# EAGLE design Hank2 (EAGLE 7.7.0)
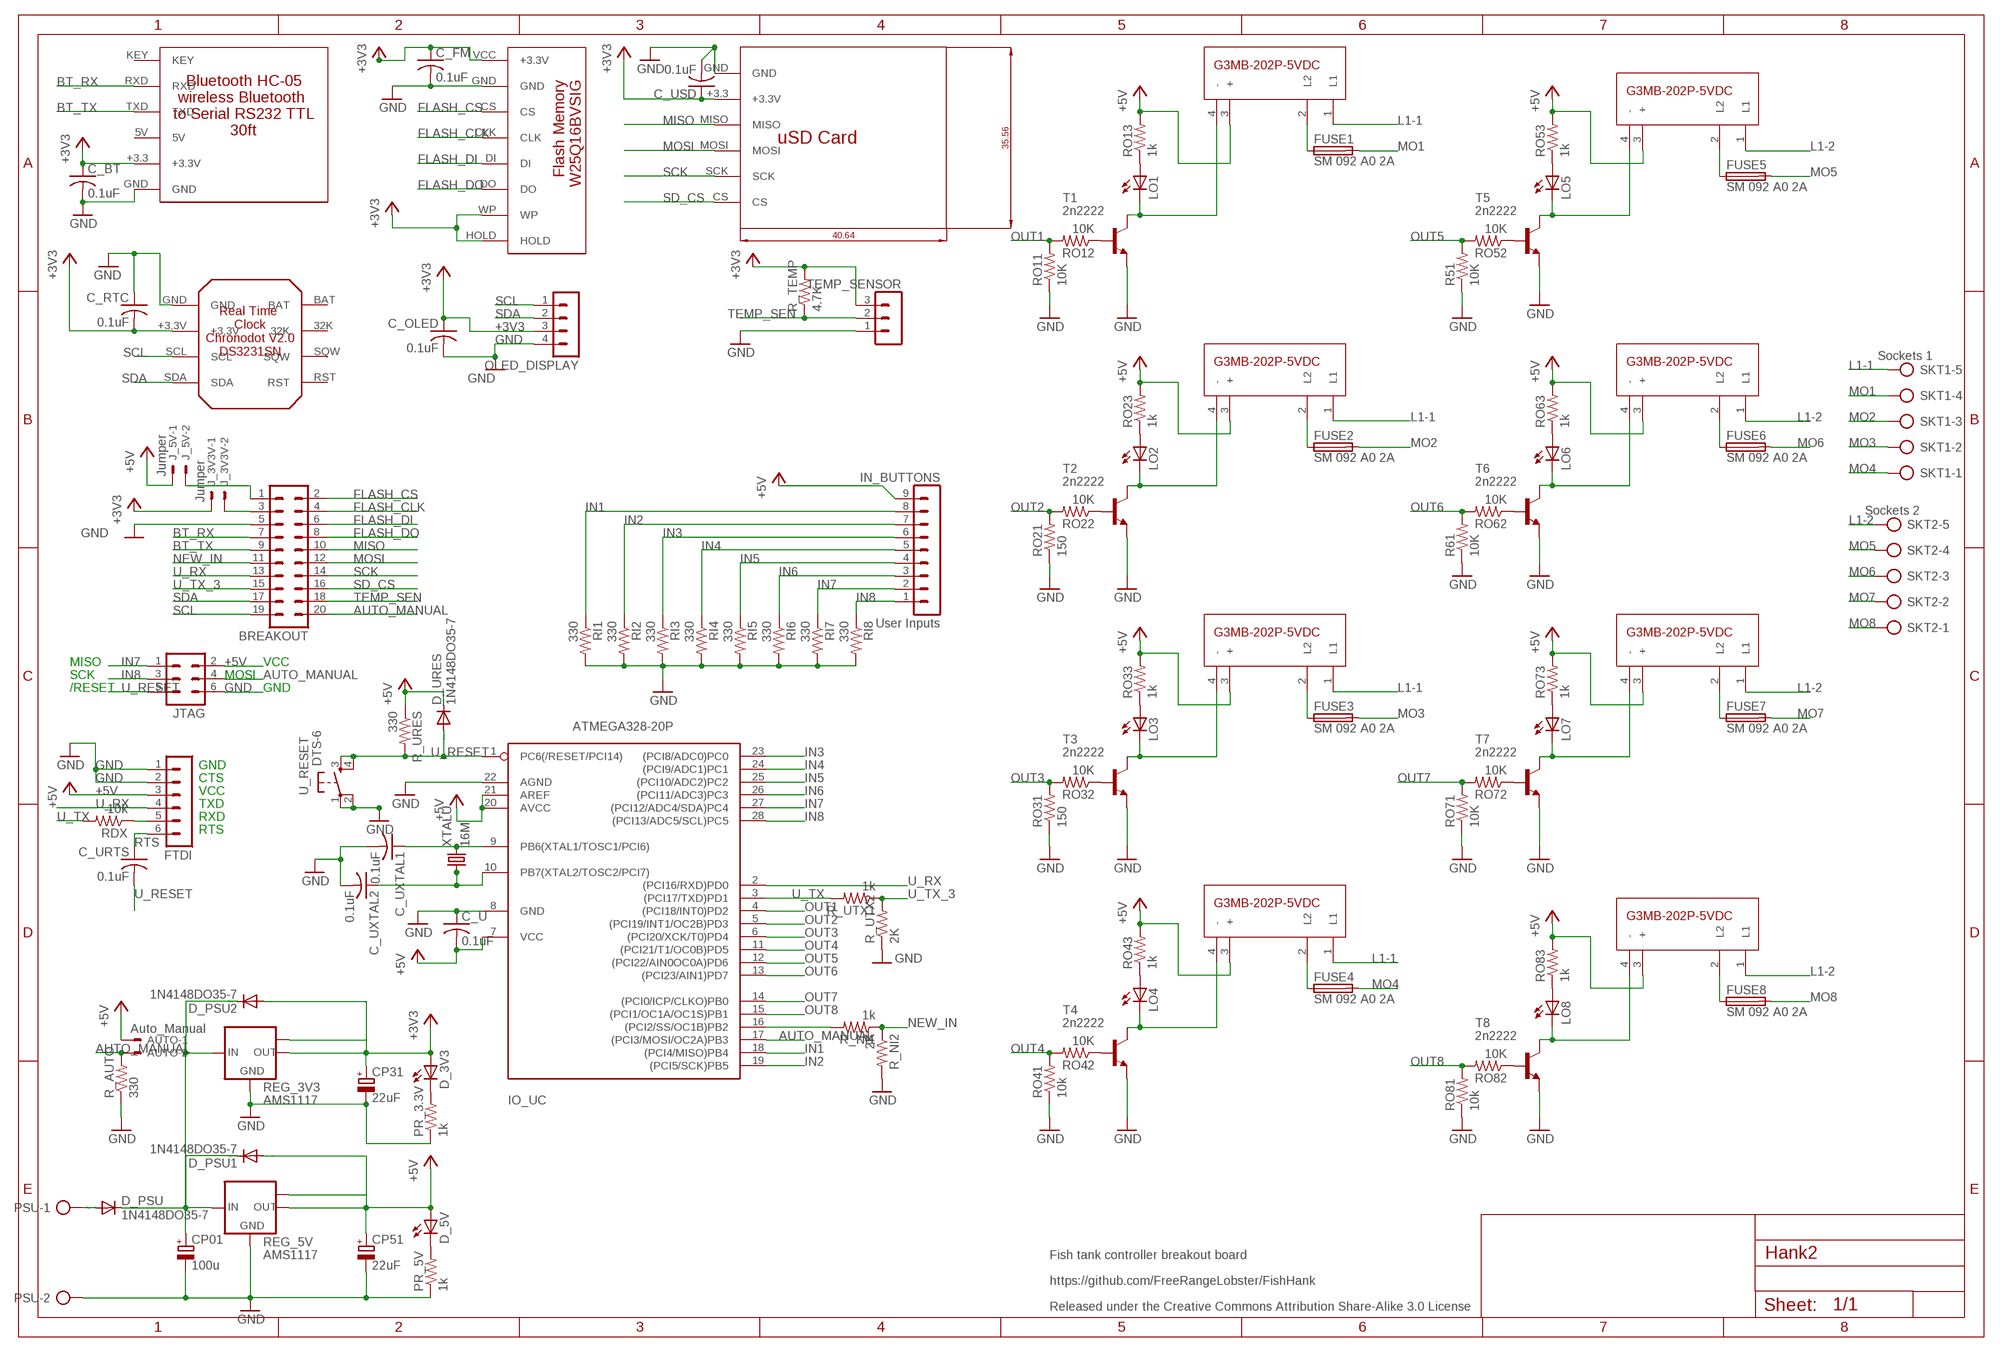
[diagram p0: schematic, sheet 1]

## Parts
AUTO  Auto_Manual  22-23-2021  [22-23-2021]
BREAKOUT  MA10-2  [MA10-2]
C_BT  0.1uF  C-US025-024X044  [C025-024X044]
C_FM  0.1uF  C-US025-024X044  [C025-024X044]
C_OLED  0.1uF  C-US025-024X044  [C025-024X044]
C_RTC  0.1uF  C-US025-024X044  [C025-024X044]
C_U  0.1uF  C-US025-024X044  [C025-024X044]
C_URTS  0.1uF  C-US025-024X044  [C025-024X044]
C_USD  0.1uF  C-US025-024X044  [C025-024X044]
C_UXTAL1  0.1uF  C-US025-024X044  [C025-024X044]
C_UXTAL2  0.1uF  C-US025-024X044  [C025-024X044]
CP01  100u  CPOL-EUE2.5-6  [E2,5-6]
CP31  22uF  CPOL-EUE2.5-6  [E2,5-6]
CP51  22uF  CPOL-EUE2.5-6  [E2,5-6]
D_3V3  LED3MM  [LED3MM]
D_5V  LED3MM  [LED3MM]
D_PSU  1N4148DO35-7  [DO35-7]
D_PSU1  1N4148DO35-7  [DO35-7]
D_PSU2  1N4148DO35-7  [DO35-7]
D_URES  1N4148DO35-7  [DO35-7]
FTDI  MA06-1  [MA06-1]
FUSE1  SM 092 A0 2A  FUSEPICOFUSE  [PICOFUSE]
FUSE2  SM 092 A0 2A  FUSEPICOFUSE  [PICOFUSE]
FUSE3  SM 092 A0 2A  FUSEPICOFUSE  [PICOFUSE]
FUSE4  SM 092 A0 2A  FUSEPICOFUSE  [PICOFUSE]
FUSE5  SM 092 A0 2A  FUSEPICOFUSE  [PICOFUSE]
FUSE6  SM 092 A0 2A  FUSEPICOFUSE  [PICOFUSE]
FUSE7  SM 092 A0 2A  FUSEPICOFUSE  [PICOFUSE]
FUSE8  SM 092 A0 2A  FUSEPICOFUSE  [PICOFUSE]
IN_BUTTONS  User Inputs  MA09-1  [MA09-1]
IO_UC  ATMEGA328-20P  [DIL28-3]
J_3V3V  Jumper  22-23-2021  [22-23-2021]
J_5V  Jumper  22-23-2021  [22-23-2021]
JTAG  MA03-2  [MA03-2]
LO1  LED3MM  [LED3MM]
LO2  LED3MM  [LED3MM]
LO3  LED3MM  [LED3MM]
LO4  LED3MM  [LED3MM]
LO5  LED3MM  [LED3MM]
LO6  LED3MM  [LED3MM]
LO7  LED3MM  [LED3MM]
LO8  LED3MM  [LED3MM]
OLED_DISPLAY  MA04-1  [MA04-1]
PR_3.3V  1k  R-US_0207/10  [0207/10]
PR_5V  1k  R-US_0207/10  [0207/10]
PSU  AK500/2  [AK500/2]
R51  10K  R-US_0207/10  [0207/10]
R61  10K  R-US_0207/10  [0207/10]
R_AUTO  330  R-US_0207/10  [0207/10]
R_NI1  1k  R-US_0207/10  [0207/10]
R_NI2  2K  R-US_0207/10  [0207/10]
R_TEMP  4.7K  R-US_0207/10  [0207/10]
R_URES  330  R-US_0207/10  [0207/10]
R_UTX1  1k  R-US_0207/10  [0207/10]
R_UTX2  2K  R-US_0207/10  [0207/10]
RDX  10k  R-US_0207/10  [0207/10]
REG_3V3  AMS1117  [SOT223]
REG_5V  AMS1117  [SOT223]
RI1  330  R-US_0207/10  [0207/10]
RI2  330  R-US_0207/10  [0207/10]
RI3  330  R-US_0207/10  [0207/10]
RI4  330  R-US_0207/10  [0207/10]
RI5  330  R-US_0207/10  [0207/10]
RI6  330  R-US_0207/10  [0207/10]
RI7  330  R-US_0207/10  [0207/10]
RI8  330  R-US_0207/10  [0207/10]
RO11  10K  R-US_0207/10  [0207/10]
RO12  10K  R-US_0207/10  [0207/10]
RO13  1k  R-US_0207/10  [0207/10]
RO21  150  R-US_0207/10  [0207/10]
RO22  10K  R-US_0207/10  [0207/10]
RO23  1k  R-US_0207/10  [0207/10]
RO31  150  R-US_0207/10  [0207/10]
RO32  10K  R-US_0207/10  [0207/10]
RO33  1k  R-US_0207/10  [0207/10]
RO41  10k  R-US_0207/10  [0207/10]
RO42  10K  R-US_0207/10  [0207/10]
RO43  1k  R-US_0207/10  [0207/10]
RO52  10K  R-US_0207/10  [0207/10]
RO53  1k  R-US_0207/10  [0207/10]
RO62  10K  R-US_0207/10  [0207/10]
RO63  1k  R-US_0207/10  [0207/10]
RO71  10K  R-US_0207/10  [0207/10]
RO72  10K  R-US_0207/10  [0207/10]
RO73  1k  R-US_0207/10  [0207/10]
RO81  10k  R-US_0207/10  [0207/10]
RO82  10K  R-US_0207/10  [0207/10]
RO83  1k  R-US_0207/10  [0207/10]
SKT1  Sockets 1  AK500/5  [AK500/5]
SKT2  Sockets 2  AK500/5  [AK500/5]
SSR1  SSR  [SSR_FOOTPRINT]
SSR2  SSR  [SSR_FOOTPRINT]
SSR3  SSR  [SSR_FOOTPRINT]
SSR4  SSR  [SSR_FOOTPRINT]
SSR5  SSR  [SSR_FOOTPRINT]
SSR6  SSR  [SSR_FOOTPRINT]
SSR7  SSR  [SSR_FOOTPRINT]
SSR8  SSR  [SSR_FOOTPRINT]
T1  2n2222  2SC458  [TO92-ECB]
T2  2n2222  2SC458  [TO92-ECB]
T3  2n2222  2SC458  [TO92-ECB]
T4  2n2222  2SC458  [TO92-ECB]
T5  2n2222  2SC458  [TO92-ECB]
T6  2n2222  2SC458  [TO92-ECB]
T7  2n2222  2SC458  [TO92-ECB]
T8  2n2222  2SC458  [TO92-ECB]
TEMP_SENSOR  MA03-1  [MA03-1]
U$1  FLASH_MEMORY  [FLASHMEMORY_FOOTPRINT]
U$4  BLUETOOTH  [BLUETOOTH_FOOTPRINT]
U$6  RTC  [RTC_FOOTPRINT]
U$7  SD_CARD_READER  [SD_CARD_READER_FOOTPRINT]
U_RESET  DTS-6  [DTS-6]
XTALU  16M  CRYSTALHC49S  [HC49/S]

## Nets
+3V3: C_BT.1 C_FM.1 C_OLED.1 C_RTC.2 C_USD.1 CP31.+ D_3V3.A D_PSU2.A J_3V3V.1 OLED_DISPLAY.3 R_TEMP.2 REG_3V3.2(OUT) REG_3V3.TAB(OUT1) TEMP_SENSOR.3 U$1.HOLD U$1.VCC(+3.3V) U$1.WP U$4.+3.3(+3.3V) U$6.+3.3V U$7.+3.3(+3.3V)
+5V: AUTO.1 C_U.2 CP51.+ D_5V.A D_PSU1.A D_URES.C FTDI.3 IN_BUTTONS.9 IO_UC.7(VCC) IO_UC.20(AVCC) IO_UC.21(AREF) J_5V.1 JTAG.2 R_URES.1 REG_5V.2(OUT) REG_5V.TAB(OUT1) RO13.2 RO23.2 RO33.2 RO43.2 RO53.2 RO63.2 RO73.2 RO83.2 SSR1.3(+) SSR2.3(+) SSR3.3(+) SSR4.3(+) SSR5.3(+) SSR6.3(+) SSR7.3(+) SSR8.3(+)
AUTO_MANUAL: AUTO.2 BREAKOUT.20 IO_UC.17((PCI3/MOSI/OC2A)PB3) JTAG.4 R_AUTO.2
BT_RX: BREAKOUT.7 U$4.RXD
BT_TX: BREAKOUT.9 U$4.TXD
CP12: CP01.+ D_PSU1.C D_PSU2.C D_PSU.C REG_3V3.3(IN) REG_5V.3(IN)
FLASH_CLK: BREAKOUT.4 U$1.CLK
FLASH_CS: BREAKOUT.2 U$1.CS
FLASH_DI: BREAKOUT.6 U$1.DI
FLASH_DO: BREAKOUT.8 U$1.DO
GND [vcc]: BREAKOUT.5 C_BT.2 C_FM.2 C_OLED.2 C_RTC.1 C_U.1 C_USD.2 C_UXTAL1.2 C_UXTAL2.2 CP01.- CP31.- CP51.- FTDI.1 FTDI.2 IO_UC.8(GND) IO_UC.22(AGND) JTAG.6 OLED_DISPLAY.4 PR_3.3V.1 PR_5V.1 PSU.2 R51.1 R61.1 R_AUTO.1 R_NI2.2 R_UTX2.1 REG_3V3.1(GND) REG_5V.1(GND) RI1.2 RI2.2 RI3.2 RI4.2 RI5.2 RI6.2 RI7.2 RI8.2 RO11.1 RO21.1 RO31.1 RO41.1 RO71.1 RO81.1 T1.E T2.E T3.E T4.E T5.E T6.E T7.E T8.E TEMP_SENSOR.1 U$1.GND U$4.GND U$6.GND U$7.GND U_RESET.1 U_RESET.2
IN1: IN_BUTTONS.8 IO_UC.18((PCI4/MISO)PB4) RI1.1
IN2: IN_BUTTONS.7 IO_UC.19((PCI5/SCK)PB5) RI2.1
IN3: IN_BUTTONS.6 IO_UC.23((PCI8/ADC0)PC0) RI3.1
IN4: IN_BUTTONS.5 IO_UC.24((PCI9/ADC1)PC1) RI4.1
IN5: IN_BUTTONS.4 IO_UC.25((PCI10/ADC2)PC2) RI5.1
IN6: IN_BUTTONS.3 IO_UC.26((PCI11/ADC3)PC3) RI6.1
IN7: IN_BUTTONS.2 IO_UC.27((PCI12/ADC4/SDA)PC4) JTAG.1 RI7.1
IN8: IN_BUTTONS.1 IO_UC.28((PCI13/ADC5/SCL)PC5) JTAG.3 RI8.1
L1-1: SKT1.5 SSR1.1(L1) SSR2.1(L1) SSR3.1(L1) SSR4.1(L1)
L1-2: SKT2.5 SSR5.1(L1) SSR6.1(L1) SSR7.1(L1) SSR8.1(L1)
L_O1: LO2.K(C) SSR2.4(-) T2.C
L_O3: LO3.K(C) SSR3.4(-) T3.C
MISO: BREAKOUT.10 U$7.MISO
MO1: FUSE1.2 SKT1.4
MO2: FUSE2.2 SKT1.3
MO3: FUSE3.2 SKT1.2
MO4: FUSE4.2 SKT1.1
MO5: FUSE5.2 SKT2.4
MO6: FUSE6.2 SKT2.3
MO7: FUSE7.2 SKT2.2
MO8: FUSE8.2 SKT2.1
MOSI: BREAKOUT.12 U$7.MOSI
N$1: BREAKOUT.1 J_5V.2
N$2: BREAKOUT.3 J_3V3V.2
N$3: FUSE1.1 SSR1.2(L2)
N$4: D_5V.K(C) PR_5V.2
N$5: D_3V3.K(C) PR_3.3V.2
N$7: D_PSU.A PSU.1
N$8: RO12.1 T1.B
N$9: RO52.1 T5.B
N$10: FUSE8.1 SSR8.2(L2)
N$11: LO5.A RO53.1
N$12: LO5.K(C) SSR5.4(-) T5.C
N$13: FUSE7.1 SSR7.2(L2)
N$14: FUSE2.1 SSR2.2(L2)
N$15: FUSE3.1 SSR3.2(L2)
N$16: LO6.A RO63.1
N$17: LO6.K(C) SSR6.4(-) T6.C
N$18: RO62.1 T6.B
N$19: FUSE6.1 SSR6.2(L2)
N$20: LO7.A RO73.1
N$21: LO7.K(C) SSR7.4(-) T7.C
N$22: RO72.1 T7.B
N$23: RO42.1 T4.B
N$24: FUSE4.1 SSR4.2(L2)
N$25: LO8.A RO83.1
N$26: LO8.K(C) SSR8.4(-) T8.C
N$27: RO32.1 T3.B
N$28: FUSE5.1 SSR5.2(L2)
N$29: LO1.A RO13.1
N$30: LO1.K(C) SSR1.4(-) T1.C
N$31: RO22.1 T2.B
N$32: C_UXTAL1.1 IO_UC.9(PB6(XTAL1/TOSC1/PCI6)) XTALU.2
N$33: LO2.A RO23.1
N$34: RO82.1 T8.B
N$35: C_UXTAL2.1 IO_UC.10(PB7(XTAL2/TOSC2/PCI7)) XTALU.1
N$37: LO3.A RO33.1
N$39: IO_UC.16((PCI2/SS/OC1B)PB2) R_NI1.2
N$41: LO4.A RO43.1
N$42: LO4.K(C) SSR4.4(-) T4.C
NEW_IN: BREAKOUT.11 R_NI1.1 R_NI2.1
OUT1: IO_UC.4((PCI18/INT0)PD2) RO11.2 RO12.2
OUT2: IO_UC.5((PCI19/INT1/OC2B)PD3) RO21.2 RO22.2
OUT3: IO_UC.6((PCI20/XCK/T0)PD4) RO31.2 RO32.2
OUT4: IO_UC.11((PCI21/T1/OC0B)PD5) RO41.2 RO42.2
OUT5: IO_UC.12((PCI22/AIN0OC0A)PD6) R51.2 RO52.2
OUT6: IO_UC.13((PCI23/AIN1)PD7) R61.2 RO62.2
OUT7: IO_UC.14((PCI0/ICP/CLKO)PB0) RO71.2 RO72.2
OUT8: IO_UC.15((PCI1/OC1A/OC1S)PB1) RO81.2 RO82.2
RTS: C_URTS.1 FTDI.6
SCK: BREAKOUT.14 U$7.SCK
SCL: BREAKOUT.19 OLED_DISPLAY.1 U$6.SCL
SD_CS: BREAKOUT.16 U$7.CS
SDA: BREAKOUT.17 OLED_DISPLAY.2 U$6.SDA
TEMP_SEN: BREAKOUT.18 R_TEMP.1 TEMP_SENSOR.2
U_RESET: C_URTS.2 D_URES.A IO_UC.1(PC6(/RESET/PCI14)) JTAG.5 R_URES.2 U_RESET.3 U_RESET.4
U_RX: BREAKOUT.13 FTDI.4 IO_UC.2((PCI16/RXD)PD0)
U_TX: IO_UC.3((PCI17/TXD)PD1) R_UTX1.2 RDX.2
U_TX_3: BREAKOUT.15 R_UTX1.1 R_UTX2.2
UTX: FTDI.5 RDX.1
Unconnected: U$4.5V U$4.KEY U$6.32K U$6.BAT U$6.RST U$6.SQW

## Notes on the sheet
- MISO | VCC
- SCK | MOSI
- /RESET | GND
- GND
- CTS
- VCC
- TXD
- RXD
- RTS
- Fish tank controller breakout board
- https://github.com/FreeRangeLobster/FishHank
- Released under the Creative Commons Attribution Share-Alike 3.0 License

## Library data of the parts
AUTO J_3V3V J_5V = con-molex:22-23-2021: .100" (2.54mm) Center Header - 2 Pin; MF: MOLEX; MPN: 22-23-2021; OC_FARNELL: 1462926; OC_NEWARK: 25C3832
BREAKOUT = con-lstb:MA10-2: PIN HEADER; OC_FARNELL: unknown; OC_NEWARK: unknown
C_BT C_FM C_OLED C_RTC C_U C_URTS C_USD C_UXTAL1 C_UXTAL2 = rcl:C-US: CAPACITOR, American symbol
CP01 CP31 CP51 = rcl:CPOL-EU: POLARIZED CAPACITOR, European symbol
D_3V3 D_5V LO1-LO8 = led:LED: LED OSRAM: - CHIPLED LG R971, LG N971, LY N971, LG Q971, LY Q971, LO R971, LY R971 LH N974, LH R974 LS Q976, LO Q976, LY Q976 LO Q996 - Hyper CHIPLED LW Q18S LB Q993, LB Q99A, LB R99A - SideLED LS A670, LO A670, LY A670, LG A670, LP A670 LB A673, LV A673, LT A673, LW A673 LH A674 LY A675 LS A676, LA A676, LO A676, LY A676, LW A676 LS A679, LY A679, LG A679 - Hyper Micro SIDELED® LS Y876, LA Y876, LO Y876, LY Y876 LT Y87S - SmartLED LW L88C, LW L88S LB L89C, LB L89S, LG L890 LS L89K, LO L89K, LY L89K LS L896, LA L896, LO L896, LY L896 - TOPLED LS T670, LO T670, LY T670, LG T670, LP T670 LSG T670, LSP T670, LSY T670, LOP T670, LYG T670 LG T671, LOG T671, LSG T671 LB T673, LV T673, LT T673, LW T673 LH T674 LS T676, LA T676, LO T676, LY T676, LB T676, LH T676, LSB T676, LW T676 LB T67C, LV T67C, LT T67C, LS T67K, LO T67K, LY T67K, LW E67C LS E67B, LA E67B, LO E67B, LY E67B, LB E67C, LV E67C, LT E67C LW T67C LS T679, LY T679, LG T679 LS T770, LO T770, LY T770, LG T770, LP T770 LB T773, LV T773, LT T773, LW T773 LH T774 LS E675, LA E675, LY E675, LS T675 LS T776, LA T776, LO T776, LY T776, LB T776 LHGB T686 LT T68C, LB T68C - Hyper Mini TOPLED® LB M676 - Mini TOPLED Santana® LG M470 LS M47K, LO M47K, LY M47K Source: http://www.osram.convergy.de LUXEON: - LUMILED® LXK2-PW12-R00, LXK2-PW12-S00, LXK2-PW14-U00, LXK2-PW14-V00 LXK2-PM12-R00, LXK2-PM12-S00, LXK2-PM14-U00 LXK2-PE12-Q00, LXK2-PE12-R00, LXK2-PE12-S00, LXK2-PE14-T00, LXK2-PE14-U00 LXK2-PB12-K00, LXK2-PB12-L00, LXK2-PB12-M00, LXK2-PB14-N00, LXK2-PB14-P00, LXK2-PB14-Q00 LXK2-PR12-L00, LXK2-PR12-M00, LXK2-PR14-Q00, LXK2-PR14-R00 LXK2-PD12-Q00, LXK2-PD12-R00, LXK2-PD12-S00 LXK2-PH12-R00, LXK2-PH12-S00 LXK2-PL12-P00, LXK2-PL12-Q00, LXK2-PL12-R00 Source: www.luxeon.com KINGBRIGHT: KA-3528ASYC Source: www.kingbright.com
D_PSU D_PSU1 D_PSU2 D_URES = diode:1N4148: DIODE high speed (Philips)
FTDI = con-lstb:MA06-1: PIN HEADER; OC_FARNELL: unknown; OC_NEWARK: unknown
FUSE1-FUSE8 = fuse:FUSE: Fuse; OC_FARNELL: unknown; OC_NEWARK: unknown
IN_BUTTONS = con-lstb:MA09-1: PIN HEADER; OC_FARNELL: unknown; OC_NEWARK: unknown
IO_UC = atmega328:ATMEGA328*P: MICROCONTROLLER 32 kBytes FLASH 2 kBytes SRAM 1 kBytes EEPROM USART 8-channel 10 bit ADC
JTAG = con-lstb:MA03-2: PIN HEADER; OC_FARNELL: unknown; OC_NEWARK: unknown
OLED_DISPLAY = con-lstb:MA04-1: PIN HEADER; OC_FARNELL: unknown; OC_NEWARK: unknown
PR_3.3V PR_5V R51 R61 R_AUTO R_NI1 R_NI2 R_TEMP R_URES R_UTX1 R_UTX2 RDX RI1-RI8 RO11-RO13 RO21-RO23 RO31-RO33 RO41-RO43 RO52 RO53 RO62 RO63 RO71-RO73 RO81-RO83 = rcl:R-US_: RESISTOR, American symbol
PSU = con-ptr500:AK500/2: CONNECTOR; OC_FARNELL: unknown; OC_NEWARK: unknown
REG_3V3 REG_5V = AMS117:AMS1117
SKT1 SKT2 = con-ptr500:AK500/5: CONNECTOR; OC_FARNELL: unknown; OC_NEWARK: unknown
SSR1-SSR8 = HankLibraries:SSR
T1-T8 = transistor:2SC458: NPN Silicon Epitaxial Planar Transistor Source: SEMTECH ELECTRONICS LTD. ... 2SC458 1.pdf
TEMP_SENSOR = con-lstb:MA03-1: PIN HEADER; OC_FARNELL: unknown; OC_NEWARK: unknown
U$1 = HankLibraries:FLASH_MEMORY
U$4 = HankLibraries:BLUETOOTH
U$6 = HankLibraries:RTC: Real Time Clock PCB Using DS3231SN. Developed by JVivas
U$7 = HankLibraries:SD_CARD_READER
U_RESET = switch-tact:DTS-6
XTALU = crystal:CRYSTAL: CRYSTAL; OC_FARNELL: 1667008; OC_NEWARK: unknown

## Net classes
1 vcc: width 0.508 mm

## Board
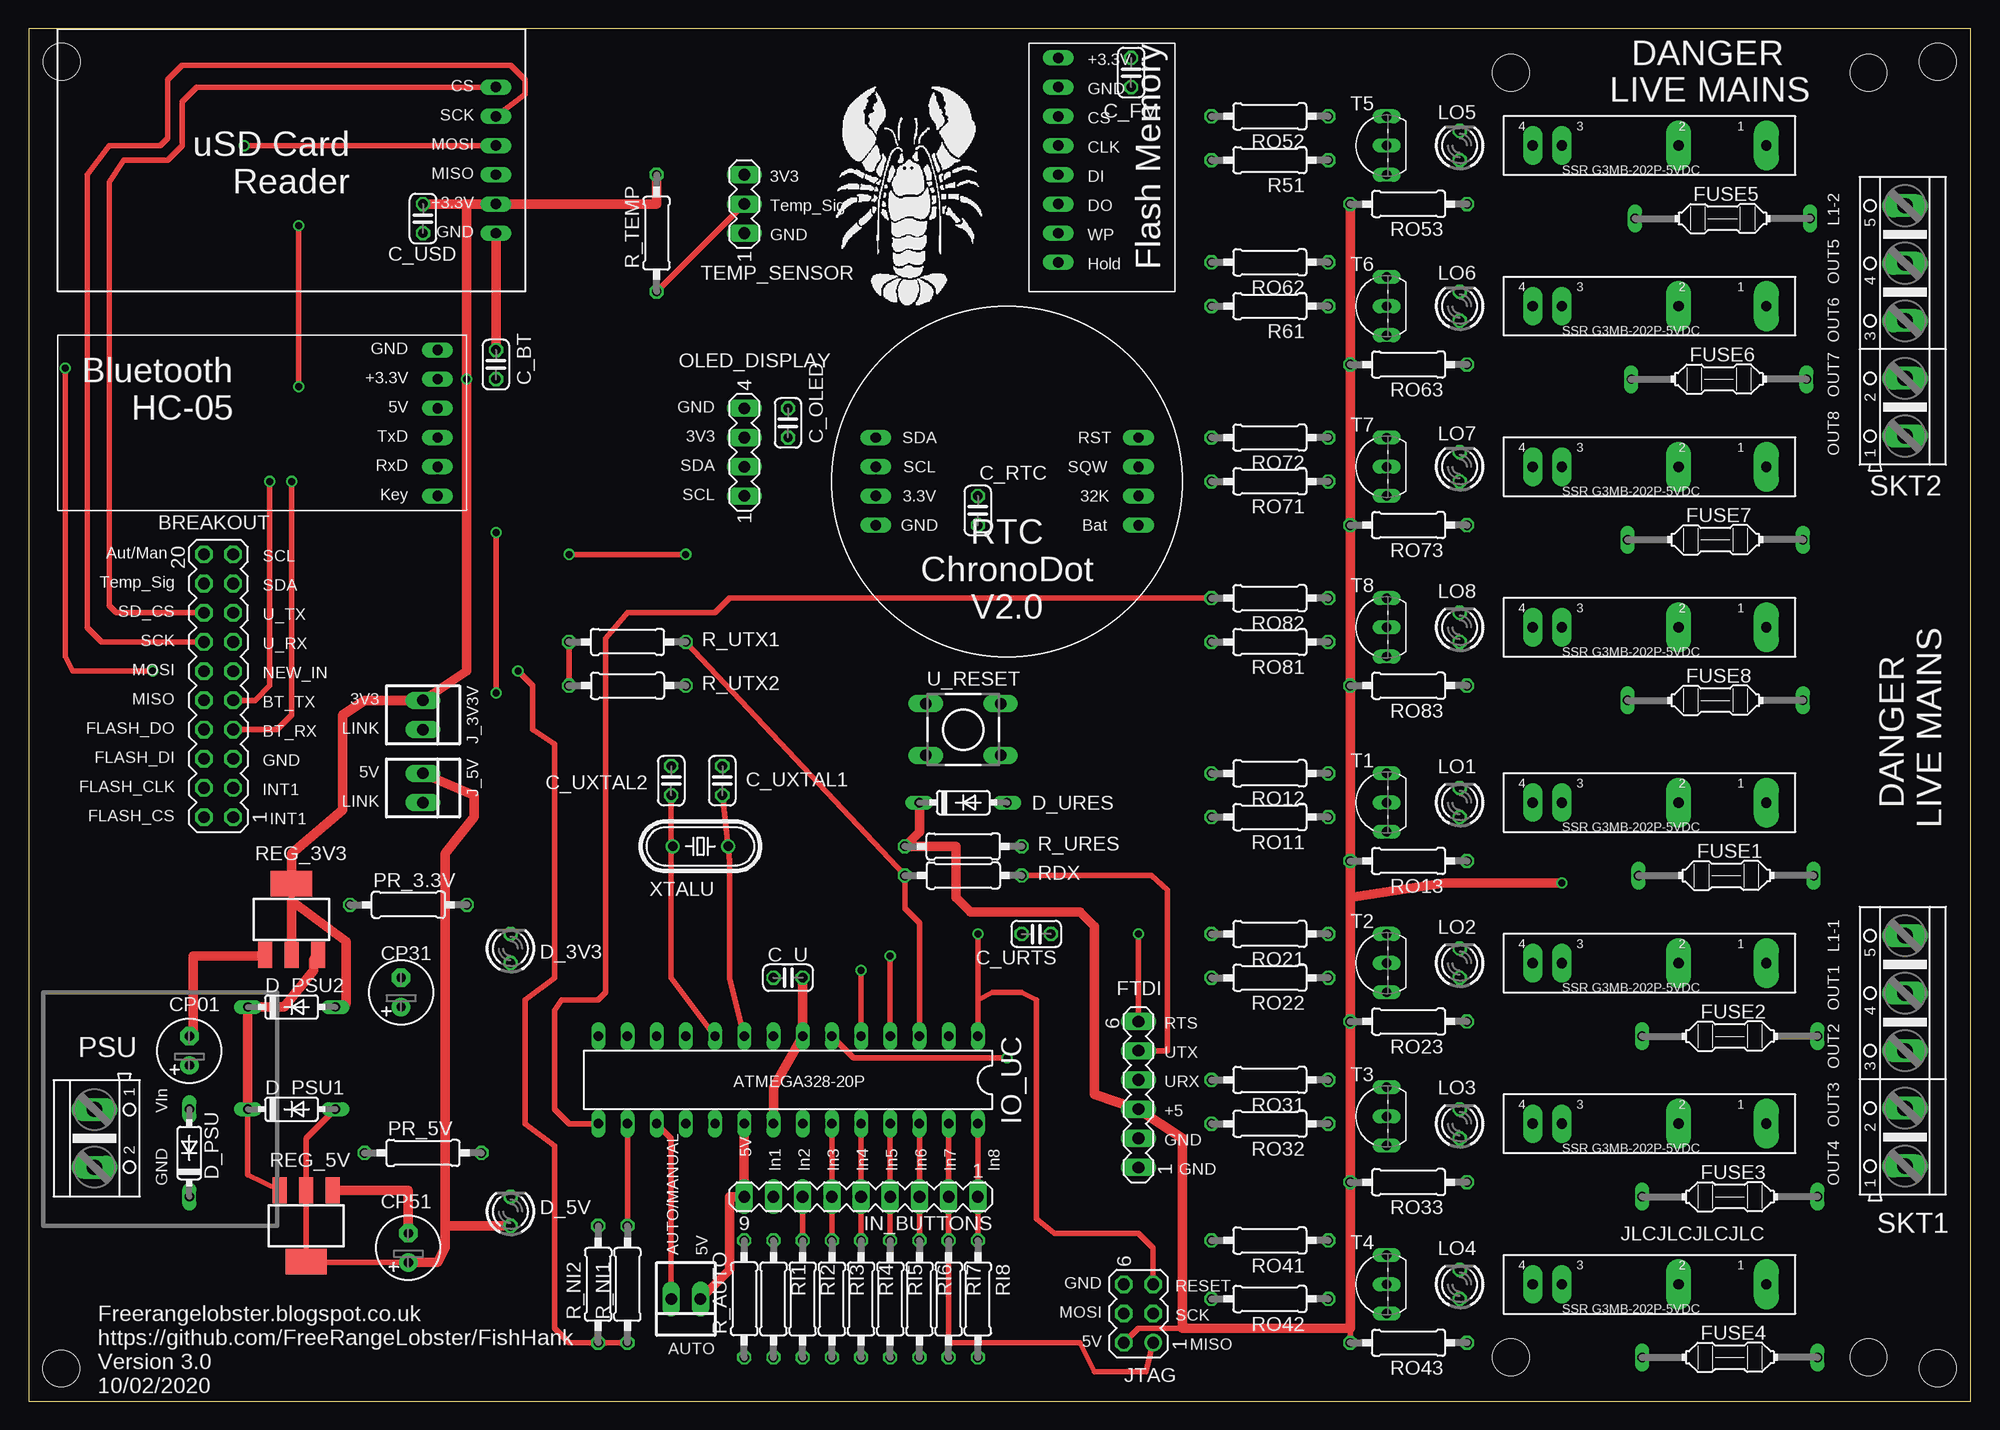
[diagram p1: board, top side]
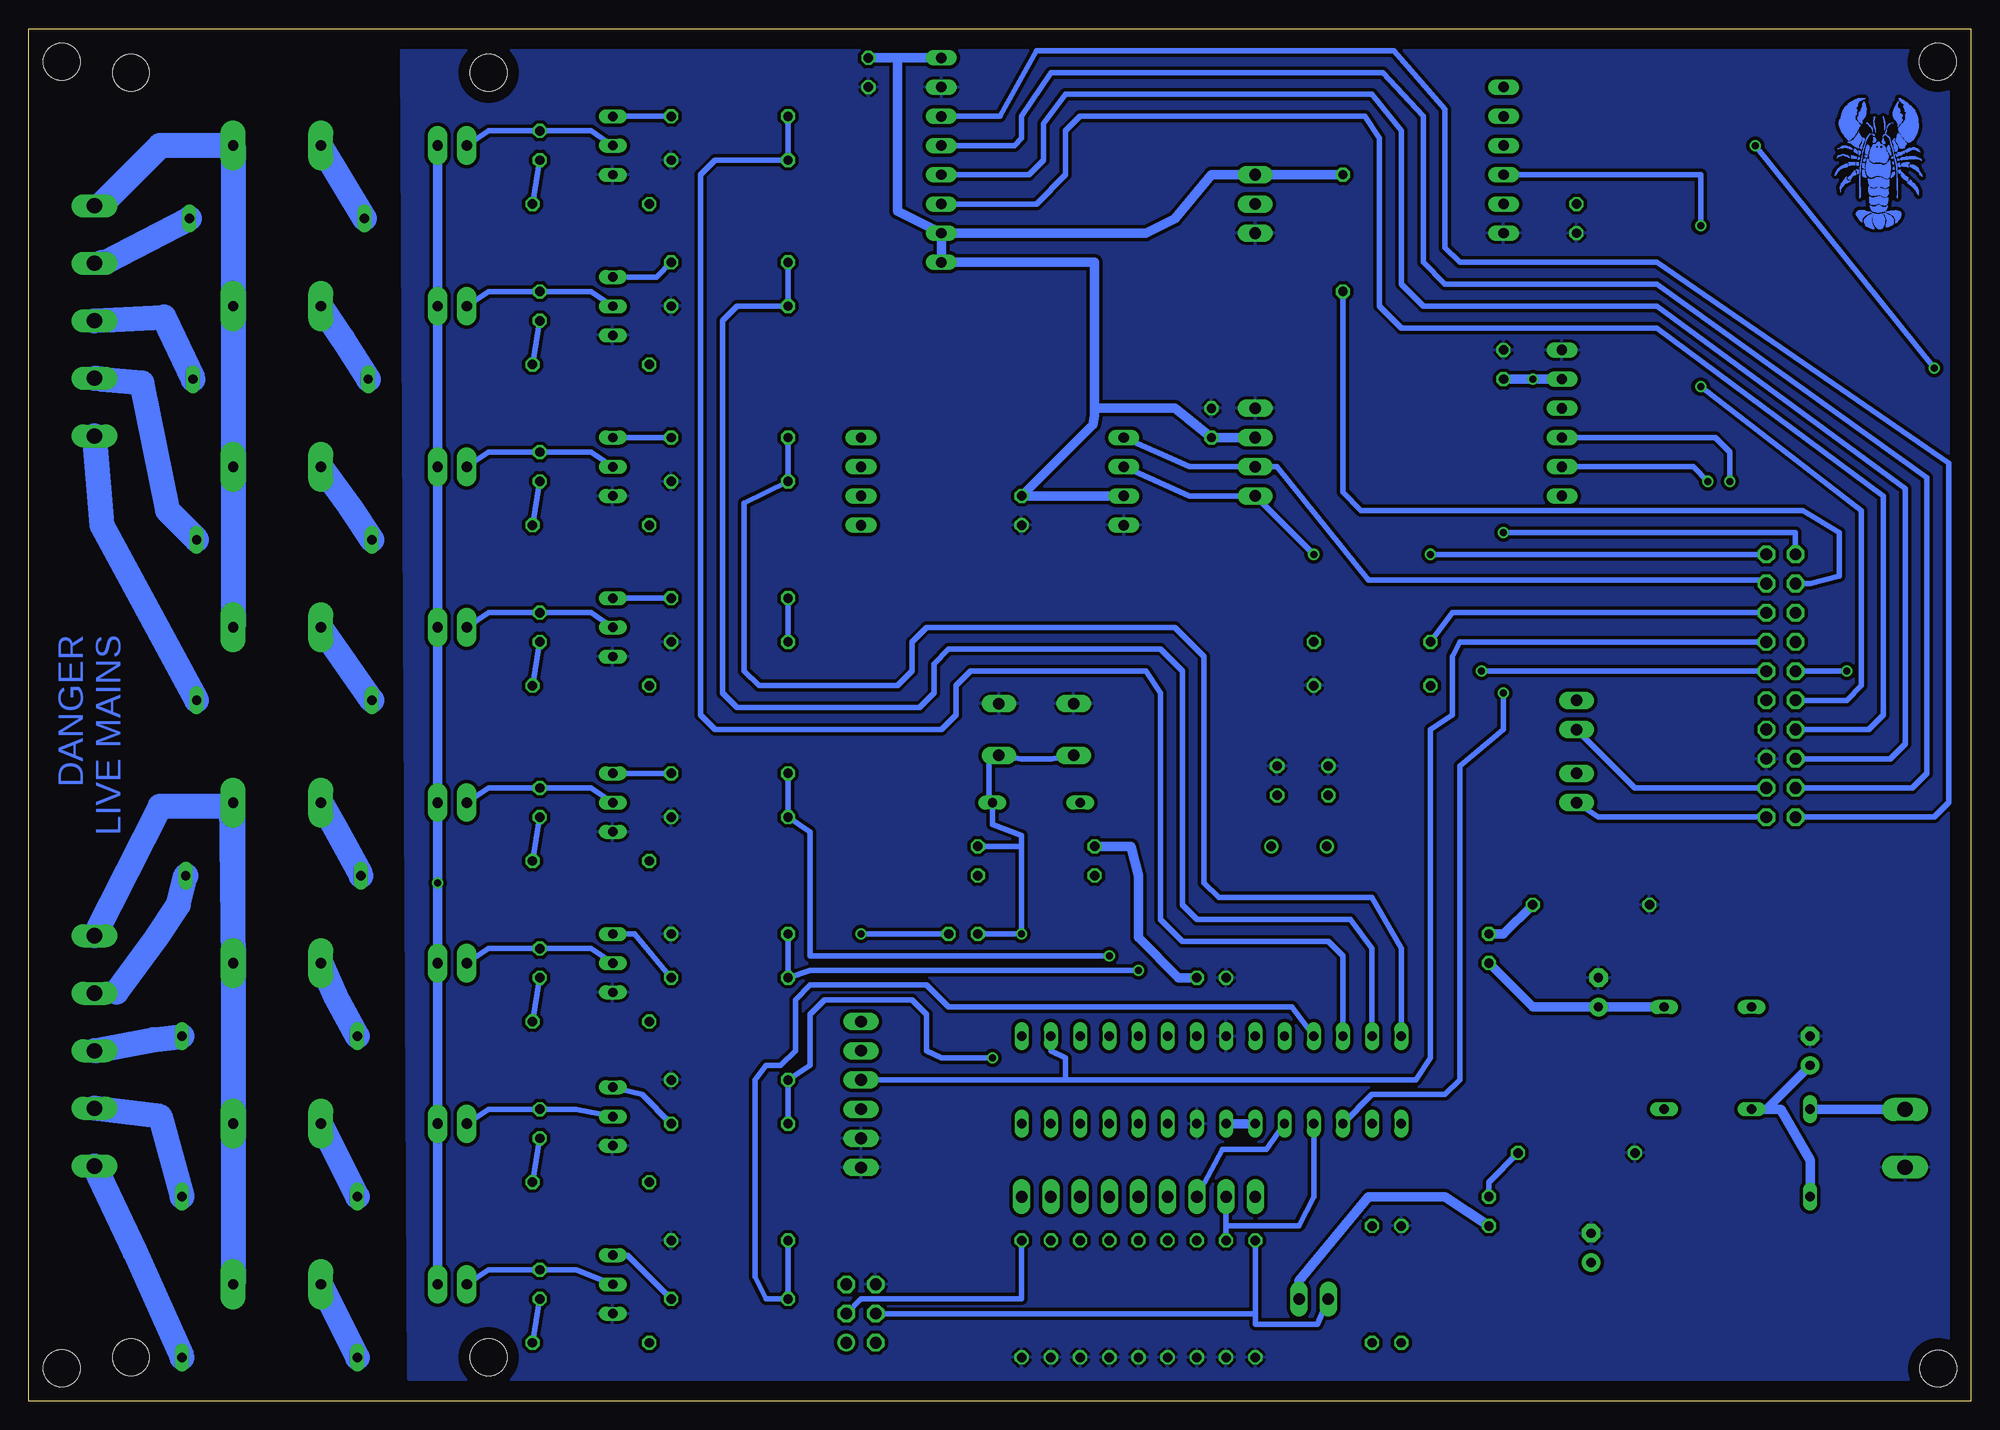
[diagram p2: board, bottom side, seen from below]

Size 168.91 x 119.38 mm. Coordinates in mm from the lower left corner, seen from the top.
Outline: 0,0 168.89,0 168.91,119.38 0,119.38 0,0
Copper layers (1*16): Top 0.0356mm / dielectric 1.5011mm / Bottom 0.0356mm
Design rules "default *": minimum track width 18mil, minimum drill 24mil, track to track 8mil, track to pad 8mil, pad to pad 8mil, via to via 8mil, smd to smd 0mil, copper to edge 40mil, drill to drill 8mil, minimum pad ring 7mil, minimum via ring 7mil, stop-mask expansion 4mil, vias tented up to drill 0mil, thermal gap 10mil
Holes 3.2 mm at 2.83,2.84 2.86,116.52 166.05,116.52 166.05,2.86 160.02,115.57 128.91,115.57 160.02,3.81 128.91,3.81

### Footprints (pad centres in the part's own frame; a part is rotated, then mirrored left to right if it is on the bottom)
22-23-2021 = drill 1 long: 1 -1.27,0; 2 1.27,0
MA10-2 = drill 1.016 octagon: 1 -11.43,-1.27; 2 -11.43,1.27; 3 -8.89,-1.27; 4 -8.89,1.27; 5 -6.35,-1.27; 6 -6.35,1.27; 7 -3.81,-1.27; 8 -3.81,1.27; 9 -1.27,-1.27; 10 -1.27,1.27; 11 1.27,-1.27; 12 1.27,1.27; 13 3.81,-1.27; 14 3.81,1.27; 15 6.35,-1.27; 16 6.35,1.27; 17 8.89,-1.27; 18 8.89,1.27; 19 11.43,-1.27; 20 11.43,1.27
C025-024X044 = drill 0.813 octagon: 1 -1.27,0; 2 1.27,0
E2,5-6 = drill 0.813 pad 1.6: + -1.27,0 | drill 0.813 pad 1.6 octagon: - 1.27,0
LED3MM = drill 0.813 octagon: A -1.27,0; K 1.27,0
DO35-7 = drill 0.813 long: A 3.81,0; C -3.81,0
MA06-1 = drill 1.016 long: 1 -6.35,0; 2 -3.81,0; 3 -1.27,0; 4 1.27,0; 5 3.81,0; 6 6.35,0
PICOFUSE = drill 0.813 long: 1 -7.62,0; 2 7.62,0
MA09-1 = drill 1.016 long: 1 -10.16,0; 2 -7.62,0; 3 -5.08,0; 4 -2.54,0; 5 0,0; 6 2.54,0; 7 5.08,0; 8 7.62,0; 9 10.16,0
DIL28-3 = drill 0.813 long: 1 -16.51,-3.81; 2 -13.97,-3.81; 3 -11.43,-3.81; 4 -8.89,-3.81; 5 -6.35,-3.81; 6 -3.81,-3.81; 7 -1.27,-3.81; 8 1.27,-3.81; 9 3.81,-3.81; 10 6.35,-3.81; 11 8.89,-3.81; 12 11.43,-3.81; 13 13.97,-3.81; 14 16.51,-3.81; 15 16.51,3.81; 16 13.97,3.81; 17 11.43,3.81; 18 8.89,3.81; 19 6.35,3.81; 20 3.81,3.81; 21 1.27,3.81; 22 -1.27,3.81; 23 -3.81,3.81; 24 -6.35,3.81; 25 -8.89,3.81; 26 -11.43,3.81; 27 -13.97,3.81; 28 -16.51,3.81
MA03-2 = drill 1.016: 1 -2.54,-1.27 | drill 1.016 octagon: 2 -2.54,1.27; 3 0,-1.27; 4 0,1.27; 5 2.54,-1.27; 6 2.54,1.27
MA04-1 = drill 1.016 long: 1 -3.81,0; 2 -1.27,0; 3 1.27,0; 4 3.81,0
0207/10 = drill 0.813 octagon: 1 -5.08,0; 2 5.08,0
AK500/2 = drill 1.321 long: 1 -2.515,0; 2 2.515,0
SOT223 = smd 1.219 x 2.235: 1 -2.311,-3.099; 2 0,-3.099; 3 2.311,-3.099 | smd 3.6 x 2.2: TAB 0,3.099
AK500/5 = drill 1.321 long: 1 -10.033,0; 2 -5.004,0; 3 0,0; 4 5.004,0; 5 10.008,0
SSR_FOOTPRINT = drill 0.9 pad 2.184 long: 1 10.16,0; 2 2.54,0 | drill 0.9 pad 1.676 long: 3 -7.62,0; 4 -10.16,0
TO92-ECB = drill 0.813 long: B 2.54,0; C 0,0; E -2.54,0
MA03-1 = drill 1.016 long: 1 -2.54,0; 2 0,0; 3 2.54,0
FLASHMEMORY_FOOTPRINT = drill 0.9 long: CLK -6.35,1.27; CS -6.35,3.81; DI -6.35,-1.27; DO -6.35,-3.81; GND -6.35,6.35; HOLD -6.35,-8.89; VCC -6.35,8.89; WP -6.35,-6.35
BLUETOOTH_FOOTPRINT = drill 0.9 long: 5V -15.24,-1.27; +3.3 -15.24,-3.81; GND -15.24,-6.35; KEY -15.24,6.35; RXD -15.24,3.81; TXD -15.24,1.27
RTC_FOOTPRINT = drill 0.9 long: 32K -11.43,0; +3.3V 11.43,0; BAT -11.43,2.54; GND 11.43,2.54; RST -11.43,-5.08; SCL 11.43,-2.54; SDA 11.43,-5.08; SQW -11.43,-2.54
SD_CARD_READER_FOOTPRINT = drill 0.9 long: +3.3 -17.78,3.81; CS -17.78,-6.35; GND -17.78,6.35; MISO -17.78,1.27; MOSI -17.78,-1.27; SCK -17.78,-3.81
DTS-6 = drill 1 long: 1 -3.25,2.25; 2 3.25,2.25; 3 -3.25,-2.25; 4 3.25,-2.25
HC49/S = drill 0.813: 1 -2.413,0; 2 2.413,0

### Placement (x,y rotation side)
AUTO  57.15,8.89 180 top
BREAKOUT  16.51,62.23 90 top
C_BT  40.64,90.17 90 top
C_FM  95.89,115.57 270 top
C_OLED  66.04,85.09 90 top
C_RTC  82.55,77.47 90 top
C_U  66.04,36.83 0 top
C_URTS  87.63,40.64 180 top
C_USD  34.29,102.87 270 top
C_UXTAL1  60.33,53.98 90 top
C_UXTAL2  55.88,53.98 90 top
CP01  13.97,30.48 90 top
CP31  32.38,35.56 90 top
CP51  33.02,13.34 90 top
D_3V3  41.91,39.37 90 top
D_5V  41.91,16.51 90 top
D_PSU  13.97,21.59 90 top
D_PSU1  22.86,25.4 0 top
D_PSU2  22.86,34.29 0 top
D_URES  81.28,52.07 0 top
FTDI  96.52,26.67 90 top
FUSE1  147.64,45.72 0 top
FUSE2  147.96,31.75 0 top
FUSE3  147.96,17.78 0 top
FUSE4  147.96,3.81 0 top
FUSE5  147.32,102.87 0 top
FUSE6  147,88.9 0 top
FUSE7  146.69,74.93 0 top
FUSE8  146.69,60.96 0 top
IN_BUTTONS  72.39,17.78 180 top
IO_UC  66.04,27.94 180 top
J_3V3V  34.29,59.69 270 top
J_5V  34.29,53.34 270 top
JTAG  96.52,7.62 90 top
LO1  124.46,52.07 90 top
LO2  124.46,38.1 90 top
LO3  124.46,24.13 90 top
LO4  124.46,10.16 90 top
LO5  124.46,109.22 90 top
LO6  124.46,95.25 90 top
LO7  124.46,81.28 90 top
LO8  124.46,67.31 90 top
OLED_DISPLAY  62.23,82.55 90 top
PR_3.3V  33.02,43.18 0 top
PR_5V  34.29,21.59 0 top
PSU  5.71,22.86 270 top
R51  107.95,107.95 180 top
R61  107.95,95.25 180 top
R_AUTO  62.23,8.89 90 top
R_NI1  52.07,10.16 90 top
R_NI2  49.53,10.16 90 top
R_TEMP  54.61,101.6 90 top
R_URES  81.28,48.26 0 top
R_UTX1  52.07,66.04 0 top
R_UTX2  52.07,62.23 180 top
RDX  81.28,45.72 180 top
REG_3V3  22.86,41.91 0 top
REG_5V  24.13,15.24 180 top
RI1  64.77,8.89 270 top
RI2  67.31,8.89 270 top
RI3  69.85,8.89 270 top
RI4  72.39,8.89 270 top
RI5  74.93,8.89 270 top
RI6  77.47,8.89 270 top
RI7  80.01,8.89 270 top
RI8  82.55,8.89 270 top
RO11  107.95,50.8 180 top
RO12  107.95,54.61 180 top
RO13  120.02,46.99 180 top
RO21  107.95,40.64 180 top
RO22  107.95,36.83 180 top
RO23  120.02,33.02 180 top
RO31  107.95,27.94 180 top
RO32  107.95,24.13 180 top
RO33  120.02,19.05 180 top
RO41  107.95,13.97 180 top
RO42  107.95,8.89 180 top
RO43  120.02,5.08 180 top
RO52  107.95,111.76 180 top
RO53  120.02,104.14 180 top
RO62  107.95,99.06 180 top
RO63  120.02,90.17 180 top
RO71  107.95,80.01 180 top
RO72  107.95,83.82 180 top
RO73  120.02,76.2 180 top
RO81  107.95,66.04 180 top
RO82  107.95,69.85 180 top
RO83  120.02,62.23 180 top
SKT1  163.19,30.48 90 top
SKT2  163.19,93.98 90 top
SSR1  140.97,52.07 0 top
SSR2  140.97,38.1 0 top
SSR3  140.97,24.13 0 top
SSR4  140.97,10.16 0 top
SSR5  140.97,109.22 0 top
SSR6  140.97,95.25 0 top
SSR7  140.97,81.28 0 top
SSR8  140.97,67.31 0 top
T1  118.11,52.07 90 top
T2  118.11,38.1 90 top
T3  118.11,24.77 90 top
T4  118.11,10.16 90 top
T5  118.11,109.22 90 top
T6  118.11,95.25 90 top
T7  118.11,81.28 90 top
T8  118.11,67.31 90 top
TEMP_SENSOR  62.23,104.14 90 top
U$1  95.89,107.95 0 top
U$4  20.32,85.09 180 top
U$6  85.09,78.74 180 top
U$7  22.86,107.95 180 top
U_RESET  81.28,58.42 0 top
XTALU  58.42,48.26 0 top

### Tracks (layer width: path | path; a pad name or v marks a point on that pad's centre or on a via)
+3V3  (via drill 0.61)
  Top 0.457: REG_3V3.TAB 22.86,43.5
  Top 0.813: REG_3V3.2 22.86,43.5 27.62,40.01 27.62,34.61 D_PSU2.A | REG_3V3.TAB 22.86,47.62 27.3,51.44 27.3,59.69 29.21,60.96 J_3V3V.1 38.1,63.5 v38.1,88.9 38.1,104.14 | 38.1,104.14 U$7.+3.3 54.61,104.14 R_TEMP.2 | 38.1,104.14 C_USD.1
  Bottom 0.457: 76.36,84.93 76.2,86.36
  Bottom 0.813: D_PSU2.A CP31.+ 38.1,34.29 D_3V3.A | OLED_DISPLAY.3 C_OLED.1 69.22,86.36 76.2,86.36 | U$6.+3.3V C_RTC.2 76.36,84.93 76.2,85.72 76.2,99.06 U$1.HOLD U$1.WP | U$4.+3.3 v38.1,88.9 C_BT.1 | R_TEMP.2 TEMP_SENSOR.3 66.04,106.68 69.22,102.87 71.75,101.6 U$1.WP | U$1.VCC 93.34,116.84 | 93.34,116.84 C_FM.1 | U$1.WP 93.34,103.5 93.34,116.84
+5V  (via drill 0.61)
  Top 0.457: D_PSU1.A 24.13,22.86 REG_5V.2 REG_5V.TAB 24.13,12.06 CP51.+ | 114.94,6.35 RO43.2 | JTAG.2 96.52,6.35 100.33,6.35 | 76.52,48.26 R_URES.1
  Top 0.813: 36.2,15.24 36.2,13.34 35.56,12.06 CP51.+ | 36.2,15.24 D_5V.A | 36.2,15.24 36.2,47.62 38.73,50.8 38.73,52.7 J_5V.1 | R_URES.1 77.47,49.53 D_URES.C | C_U.2 IO_UC.7 64.77,27.3 IO_UC.21 | AUTO.1 60.96,11.43 60.96,17.78 IN_BUTTONS.9 IO_UC.20 | RO53.2 RO63.2 RO73.2 RO83.2 RO13.2 114.94,43.81 | 114.94,43.81 RO23.2 RO33.2 114.94,6.35 100.33,6.35 100.33,22.86 FTDI.3 92.71,26.67 92.71,41.27 91.44,42.55 81.92,42.55 80.64,43.81 80.64,48.26 76.52,48.26 | 114.94,43.81 123.19,45.09 v133.35,45.09
  Bottom 0.813: IO_UC.21 IO_UC.20 | R_URES.1 73.03,48.26 72.39,45.72 72.39,40.32 68.9,36.83 C_U.2 | D_5V.A 45.72,17.78 52.39,17.78 58.42,10.48 AUTO.1 | SSR4.3 SSR3.3 SSR2.3 v133.35,45.09 SSR1.3 SSR8.3 SSR7.3 SSR6.3 SSR5.3
AUTO_MANUAL  (via drill 0.61)
  Top 0.457: IO_UC.17 55.88,22.86 AUTO.2 | v40.64,61.59 v40.64,75.56
  Bottom 0.457: 62.23,7.62 62.23,6.67 56.83,6.67 AUTO.2 | 62.23,7.62 R_AUTO.2 | BREAKOUT.20 15.24,75.56 v40.64,75.56 | v40.64,61.59 40.64,58.42 44.45,55.24 44.45,27.94 45.72,26.67 52.07,26.67 IO_UC.17 | 62.23,7.62 JTAG.4
BT_RX  (via drill 0.61)
  Top 0.457: v22.86,80.01 22.86,59.69 21.59,58.42 BREAKOUT.7
  Bottom 0.457: U$4.RXD 24.13,81.28 v22.86,80.01
BT_TX  (via drill 0.61)
  Top 0.457: v20.95,80.01 20.95,62.23 19.68,60.96 BREAKOUT.9
  Bottom 0.457: U$4.TXD 22.23,83.82 20.95,82.55 v20.95,80.01
CP12
  Top 0.457: 24.77,38.42 25.08,38.73 REG_3V3.3 | D_PSU1.C 19.05,19.68 REG_5V.3
  Top 0.813: 24.77,38.42 24.77,37.47 22.23,34.29 D_PSU2.C D_PSU1.C
  Bottom 0.457: D_PSU1.C 17.78,25.4
  Bottom 0.813: D_PSU.C 13.97,20.95 16.51,25.4 D_PSU1.C | 17.78,25.4 CP01.+
FLASH_CLK
  Bottom 0.457: U$1.CLK 83.19,109.22 82.55,109.86 82.55,111.76 80.01,115.57 51.12,115.57 47.62,111.76 47.62,99.06 45.72,97.16 27.3,97.16 3.81,80.33 3.81,54.61 5.08,53.34 BREAKOUT.4
FLASH_CS
  Bottom 0.457: U$1.CS 84.45,111.76 81.28,117.47 50.16,117.47 45.72,112.39 45.72,100.33 44.45,99.06 27.3,99.06 1.91,81.6 1.91,52.07 3.17,50.8 BREAKOUT.2
FLASH_DI
  Bottom 0.457: U$1.DI 81.92,106.68 80.64,107.95 80.64,111.12 78.74,113.67 52.07,113.67 49.53,110.49 49.53,97.16 47.62,95.25 27.3,95.25 5.71,79.38 5.71,57.15 6.99,55.88 BREAKOUT.6
FLASH_DO
  Bottom 0.457: U$1.DO 81.28,104.14 78.74,106.68 78.74,110.49 77.47,111.76 52.7,111.76 51.44,109.86 51.44,95.25 49.53,93.34 27.3,93.34 7.62,78.74 7.62,59.69 8.89,58.42 BREAKOUT.8
GND
  Top 0.813: REG_5V.1 33.02,18.34 CP51.- | CP01.- 14.29,31.75 14.29,38.73 20.55,38.73 REG_3V3.1 | C_BT.2 U$7.GND
  pour Bottom (isolate 0.305): 1.91,117.47 136.53,117.47 135.89,1.91 1.91,1.91
IN1
  Bottom 0.457: IO_UC.18 57.15,17.78 58.42,15.24 64.77,15.24 | RI1.1 64.77,15.24 | 64.77,15.24 IN_BUTTONS.8
IN2
  Top 0.457: IN_BUTTONS.7 RI2.1
  Bottom 0.457: IO_UC.19 61.28,21.91 65.09,21.91 IN_BUTTONS.7
IN3
  Top 0.457: RI3.1 IN_BUTTONS.6 IO_UC.23
IN4
  Top 0.457: RI4.1 IN_BUTTONS.5 IO_UC.24
IN5
  Top 0.457: RI5.1 IN_BUTTONS.4 IO_UC.25
IN6
  Top 0.457: RI6.1 IN_BUTTONS.3 IO_UC.26
IN7
  Top 0.457: IO_UC.27 IN_BUTTONS.2 RI7.1 80.01,5.08 91.44,5.08 92.71,2.54 97.16,2.54 JTAG.1
IN8
  Top 0.457: RI8.1 IN_BUTTONS.1 IO_UC.28
  Bottom 0.457: JTAG.3 96.52,8.89 82.55,8.89 RI8.1
L1-1
  Bottom 0.457: 151.45,51.75 151.29,52.23 151.76,52.39 151.13,40.32
  Bottom 2.184: SSR4.1 SSR3.1 SSR2.1 151.29,52.23 | 151.45,51.75 157.48,51.75 SKT1.5 | 151.13,40.32 SSR1.1
L1-2
  Bottom 0.457: 162.56,104.14 SKT2.5
  Bottom 2.184: SSR8.1 SSR7.1 SSR6.1 SSR5.1 157.48,109.22 162.56,104.14
L_O1
  Bottom 0.457: T2.C 120.02,39.37 LO2.K 128.91,39.37 SSR2.4
L_O3
  Bottom 0.457: T3.C 121.28,25.4 LO3.K 128.91,25.4 SSR3.4
MISO  (via drill 0.61)
  Top 0.457: v23.5,88.27 v23.5,102.23
  Bottom 0.457: U$7.MISO 23.5,106.68 v23.5,102.23 | v23.5,88.27 9.53,77.47 9.53,62.23 10.79,60.96 BREAKOUT.10
MO1
  Bottom 0.457: 161.29,35.56 SKT1.4
  Bottom 2.184: FUSE1.2 155.89,43.18 157.8,40.32 161.29,35.56
MO2
  Bottom 2.184: FUSE2.2 158.12,31.43 SKT1.3
MO3
  Bottom 2.184: FUSE3.2 157.48,24.77 SKT1.2
MO4
  Bottom 2.184: FUSE4.2 159.7,13.02 SKT1.1
MO5
  Bottom 0.457: 162.56,99.06 SKT2.4
  Bottom 2.184: FUSE5.2 162.24,99.06 162.56,99.06
MO6
  Bottom 2.184: FUSE6.2 157.16,94.3 SKT2.3
MO7
  Bottom 2.184: FUSE7.2 156.84,77.47 159.07,88.58 162.56,88.9 SKT2.2
MO8
  Bottom 2.184: FUSE8.2 162.56,76.2 SKT2.1
MOSI  (via drill 0.61)
  Top 0.457: v18.73,109.22 U$7.MOSI | v3.17,89.85 3.17,64.77 3.81,63.5 v10.79,63.5 | BREAKOUT.12 15.56,63.5
  Bottom 0.457: v3.17,89.85 v18.73,109.22 | BREAKOUT.12 v10.79,63.5
N$1
  Bottom 0.457: J_5V.2 32.38,50.8 BREAKOUT.1
N$2
  Bottom 0.457: J_3V3V.2 29.21,53.34 BREAKOUT.3
N$3
  Bottom 2.184: FUSE1.1 142.24,49.85 SSR1.2
N$4
  Bottom 0.457: PR_5V.2 41.91,19.05 D_5V.K
N$5
  Bottom 0.813: PR_3.3V.2 40.64,40.64 D_3V3.K
N$7
  Bottom 0.457: 5.08,25.4 PSU.1
  Bottom 0.813: 5.08,25.4 D_PSU.A
N$8
  Bottom 0.457: T1.B RO12.1
N$9
  Bottom 0.457: T5.B RO52.1
N$10
  Bottom 2.184: SSR8.2 FUSE8.1
N$11
  Bottom 0.457: LO5.A RO53.1
N$12
  Bottom 0.457: T5.C 120.02,110.49 LO5.K 128.91,110.49 SSR5.4
N$13
  Bottom 2.184: FUSE7.1 140.97,77.79 SSR7.2
N$14
  Bottom 2.184: FUSE2.1 142.24,35.24 SSR2.2
N$15
  Bottom 2.184: SSR3.2 FUSE3.1
N$16
  Bottom 0.457: LO6.A RO63.1
N$17
  Bottom 0.457: T6.C 120.02,96.52 LO6.K 128.91,96.52 SSR6.4
N$18
  Bottom 0.457: RO62.1 114.3,97.79 T6.B
N$19
  Bottom 2.184: FUSE6.1 141.6,92.39 SSR6.2
N$20
  Bottom 0.457: LO7.A RO73.1
N$21
  Bottom 0.457: T7.C 120.02,82.55 LO7.K 128.91,82.55 SSR7.4
N$22
  Bottom 0.457: T7.B RO72.1
N$23
  Bottom 0.457: RO42.1 116.84,12.7 T4.B
N$24
  Bottom 2.184: SSR4.2 FUSE4.1
N$25
  Bottom 0.457: LO8.A RO83.1
N$26
  Bottom 0.457: T8.C 120.02,68.58 LO8.K 128.91,68.58 SSR8.4
N$27
  Bottom 0.457: RO32.1 115.57,26.67 T3.B
N$28
  Bottom 2.184: SSR5.2 FUSE5.1
N$29
  Bottom 0.457: LO1.A RO13.1
N$30
  Bottom 0.457: T1.C 120.02,53.34 LO1.K 128.91,53.34 SSR1.4
N$31
  Bottom 0.457: RO22.1 116.2,40.64 T2.B
N$32
  Top 0.457: C_UXTAL1.1 XTALU.2 60.96,46.99 60.96,36.83 IO_UC.9
N$33
  Bottom 0.457: LO2.A RO23.1
N$34
  Bottom 0.457: T8.B RO82.1
N$35
  Top 0.457: C_UXTAL2.1 55.88,48.26 XTALU.1 55.88,47.62 55.88,36.83 IO_UC.10
N$37
  Bottom 0.457: LO3.A RO33.1
N$39
  Top 0.457: IO_UC.16 R_NI1.2
N$41
  Bottom 0.457: LO4.A RO43.1
N$42
  Bottom 0.457: T4.C 121.28,11.43 LO4.K 128.91,11.43 SSR4.4
NEW_IN  (via drill 0.61)
  Top 0.457: R_NI1.1 R_NI2.1 46.99,5.08 45.72,6.35 45.72,22.23 43.18,24.13 43.18,34.92 45.72,36.83 45.72,57.15 43.81,58.42 43.81,62.23 v42.55,63.5
  Bottom 0.457: v42.55,63.5 BREAKOUT.11
OUT1  (via drill 0.61)
  Top 0.457: v74.93,38.73 IO_UC.4
  Bottom 0.457: v74.93,38.73 100.97,38.73 100.97,49.53 RO11.2 RO12.2
OUT2  (via drill 0.61)
  Top 0.457: v72.39,37.47 IO_UC.5
  Bottom 0.457: v72.39,37.47 100.97,37.47 RO22.2 RO21.2
OUT3  (via drill 0.61)
  Top 0.457: IO_UC.6 71.75,29.84 v85.09,29.84
  Bottom 0.457: RO32.2 RO31.2 100.97,29.21 100.97,33.66 99.69,34.92 92.08,34.92 90.81,33.66 90.81,30.48 89.53,29.84 v85.09,29.84
OUT4
  Bottom 0.457: RO41.2 RO42.2 104.78,8.89 105.73,10.79 105.73,27.94 104.78,29.21 103.5,29.21 102.23,30.48 102.23,34.92 100.97,36.2 90.81,36.2 88.9,34.29 59.05,34.29 IO_UC.11
OUT5
  Bottom 0.457: IO_UC.12 54.61,38.73 55.88,40.01 68.58,40.01 70.48,41.91 70.48,61.59 71.75,63.5 87,63.5 88.27,62.23 88.27,59.69 89.53,58.42 109.22,58.42 110.49,59.69 110.49,106.68 109.22,107.95 R51.2 RO52.2
OUT6
  Bottom 0.457: IO_UC.13 52.07,39.37 53.98,41.91 67.31,41.91 68.58,43.18 68.58,63.5 70.48,65.41 88.9,65.41 90.17,64.14 90.17,61.59 91.44,60.33 107.31,60.33 108.58,61.59 108.58,93.98 107.31,95.25 R61.2 RO62.2
OUT7
  Bottom 0.457: IO_UC.14 49.53,39.37 52.07,43.81 65.41,43.81 66.67,45.09 66.67,64.77 69.22,67.31 90.81,67.31 92.08,66.04 92.08,63.5 93.34,62.23 105.41,62.23 106.68,63.5 106.68,78.11 RO71.2 RO72.2
OUT8
  Top 0.457: IO_UC.15 46.99,24.13 45.72,25.4 45.72,33.97 46.35,34.92 49.53,34.92 50.16,35.56 50.16,66.36 52.07,68.58 59.69,68.58 60.96,69.85 RO82.2
  Bottom 0.457: RO82.2 RO81.2
RTS  (via drill 0.61)
  Top 0.457: FTDI.6 v96.52,40.64
  Bottom 0.457: v96.52,40.64 C_URTS.1
SCK
  Top 0.457: U$7.SCK 43.18,113.67 43.18,114.94 41.91,116.2 13.34,116.2 12.06,114.94 12.06,109.86 11.43,109.22 6.99,109.22 5.08,106.68 5.08,67.31 6.35,66.04 BREAKOUT.14
SCL  (via drill 0.61)
  Top 0.457: v57.15,73.66 v46.99,73.66
  Bottom 0.457: U$6.SCL 67.94,78.74 OLED_DISPLAY.1 v57.15,73.66 | v46.99,73.66 BREAKOUT.19
SD_CS
  Top 0.457: U$7.CS 14.61,114.3 13.34,113.03 13.34,109.22 12.06,107.95 8.26,107.95 6.99,106.05 6.99,69.22 7.62,68.58 BREAKOUT.16
SDA
  Bottom 0.457: U$6.SDA 67.94,81.28 OLED_DISPLAY.2 60.33,81.28 52.39,71.44 18.1,71.44 BREAKOUT.17
TEMP_SEN
  Top 0.457: TEMP_SENSOR.2 R_TEMP.1
  Bottom 0.457: BREAKOUT.18 13.97,71.12 11.43,71.75 11.43,75.56 14.61,77.47 53.02,77.47 54.61,79.06 R_TEMP.1
U_RESET  (via drill 0.61)
  Top 0.457: v82.55,40.64 82.55,34.92 | 82.55,34.92 IO_UC.1 | JTAG.5 97.79,13.34 96.52,14.61 89.22,14.61 87.63,15.88 87.63,34.92 86.36,35.56 83.82,35.56 82.55,34.92
  Bottom 0.457: U_RESET.3 80.01,55.88 82.55,55.88 U_RESET.4 85.41,55.88 85.41,52.39 D_URES.A 85.09,50.16 82.55,49.21 82.55,48.26 | 82.55,48.26 v82.55,40.64 C_URTS.2 | 82.55,48.26 R_URES.2
U_RX
  Bottom 0.457: 78.74,27.94 78.74,29.84 80.01,30.48 IO_UC.2 | FTDI.4 78.74,27.94 | 78.74,27.94 48.26,27.94 46.99,29.84 46.99,58.42 45.09,59.69 45.09,64.77 44.45,66.04 BREAKOUT.13
U_TX
  Top 0.457: IO_UC.3 77.47,41.59 76.2,42.86 RDX.2 R_UTX1.2
U_TX_3
  Top 0.457: R_UTX1.1 R_UTX2.2
  Bottom 0.457: BREAKOUT.15 45.09,68.58 R_UTX1.1
UTX
  Top 0.457: RDX.1 97.67,45.72 99.06,44.45 99.06,30.48 FTDI.5
(copper drawn outside any net)
  shapes: Bottom area x1752

### Text on the board
Bottom: DANGER / LIVE MAINS
tNames: DANGER | LIVE MAINS | 3V3 | Temp_Sig | L1-2 | GND | OUT5 | OUT6 | GND | OUT7 | 3V3 | SDA | OUT8 | SCL | Aut/Man | SCL | Temp_Sig | SDA | SD_CS | U_TX | SCK | U_RX | MOSI | NEW_IN | MISO | 3V3 | BT_TX | FLASH_DO | LINK | BT_RX | FLASH_DI | GND | 5V | FLASH_CLK | INT1 | LINK | FLASH_CS | INT1 | DANGER / LIVE MAINS | L1-1 | OUT1 | RTS | UTX | OUT2 | ATMEGA328-20P | URX | VIn | +5 | OUT3 | GND | 5V | In1 | In2 | In3 | In4 | In5 | In6 | In7 | In8 | GND | GND | OUT4 | JLCJLCJLCJLC | AUTO/MANUAL | 5V | GND | RESET | MOSI | SCK | 5V | MISO | Freerangelobster.blogspot.co.uk / https://github.com/FreeRangeLobster/FishHank / Version 3.0 / 10/02/2020